# EAGLE schematic SolenoidWiring (EAGLE 7.6.0)
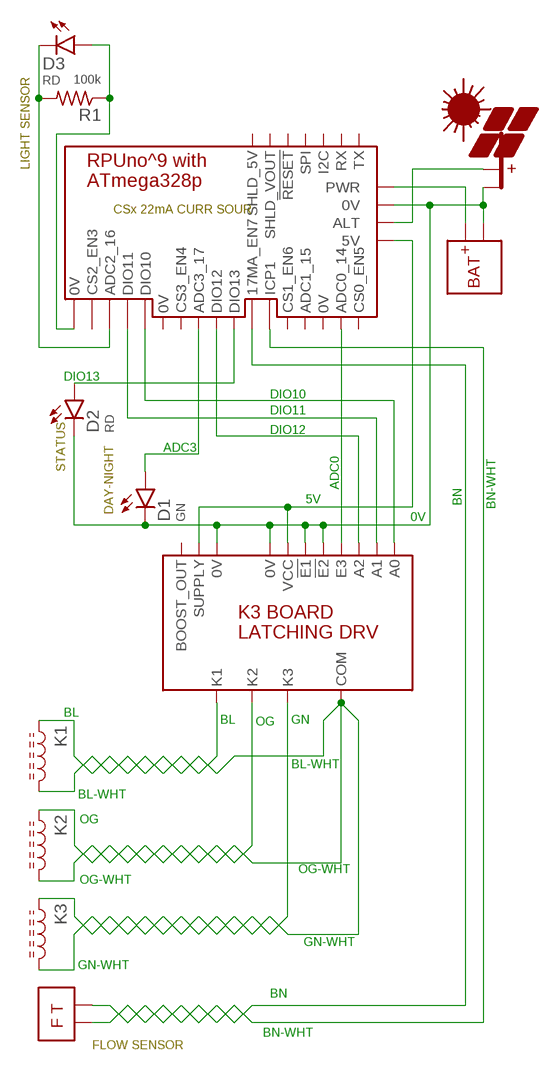
[diagram p0: schematic, sheet 1]

## Parts
BM1  RPUNO  [NA-30]
D1  GN  LED5MM  [LED5MM]
D2  RD  LED5MM  [LED5MM]
D3  RD  LED5MM  [LED5MM]
K1  L0805  [C0805(2012)]
K2  L0805  [C0805(2012)]
K3  L0805  [C0805(2012)]
PV4  PV  [NA-30]
R1  100k  R0805  [C0805(2012)]
U$1  K3  [NA-30]
U$2  FT  [NA-30]
U$7  BAT  [NA-30]

## Nets
0V: BM1.9(0V) D1.K D2.K PV4.2(-PV) U$1.1(!E1) U$1.2(!E2) U$1.3(0V) U$1.4(0V) U$7.2(-BAT)
5V: BM1.19(5V) U$1.14(SUPPLY) U$1.15(VCC)
ADC0: BM1.11(ADC0_14) U$1.10(E3)
ADC3: BM1.16(ADC3_17) D1.A
BL: K1.1 U$1.11(K1)
BL-WHT: K1.2 U$1.9(COM)
BN: BM1.21(17MA_EN7) U$2.2(PWR)
BN-WHT: BM1.12(ICP1) U$2.1(PL)
DIO10: BM1.15(DIO10) U$1.5(A0)
DIO11: BM1.14(DIO11) U$1.6(A1)
DIO12: BM1.17(DIO12) U$1.7(A2)
DIO13: BM1.18(DIO13) D2.A
GN: K3.1 U$1.13(K3)
GN-WHT: K3.2
N$1: BM1.8(PWR) U$7.1(+BAT)
N$2: BM1.27(0V) D3.A R1.1
N$3: BM1.13(ADC2_16) D3.K R1.2
N$34: BM1.20(ALT) PV4.1(+PV)
OG: K2.1 U$1.12(K2)
OG-WHT: K2.2
Unconnected: BM1.1(TX) BM1.2(RX) BM1.3(I2C) BM1.4(SPI) BM1.5(!RESET) BM1.6(SHLD_5V) BM1.7(SHLD_VOUT) BM1.10(ADC1_15) BM1.22(CS1_EN6) BM1.23(CS0_EN5) BM1.24(CS2_EN3) BM1.26(0V) BM1.28(0V) BM1.29(CS3_EN4) U$1.8(BOOST_OUT)

## Notes on the sheet
- LIGHT SENSOR
- STATUS
- DAY-NIGHT
- FLOW SENSOR

## Library data of the parts
BM1 = Documentation:RPUNO: BM /w 328p
D1-D3 = D-LED:LED: LED 120120WH [CREE,XHGAWT-00-0000-00000HXE1] LED WHITE 6500K 150LUM-W120120
K1-K3 = L-PWR:L: Inductor
PV4 = Documentation:PV
R1 = R-C:R: Resiistor American-style symbol
U$1 = Documentation:K3: Latching Solenoids
U$2 = Documentation:FT
U$7 = Documentation:BAT